# Altium schematic sheet Step_Down.SchDoc
size 297 x 209 mm; SheetNumber: 9; SheetTotal: 9
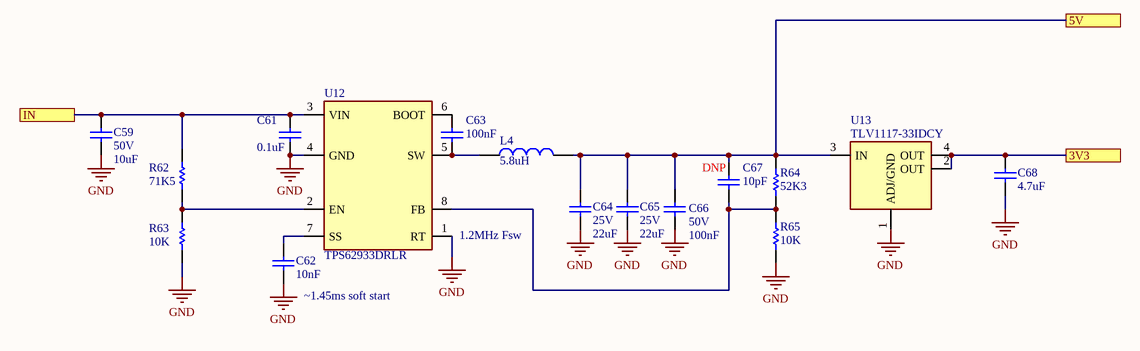
[diagram p0: Step_Down.SchDoc]

## Parts
C59  Voltage Rating: 50V  Capacitance: 10uF  [CAPC1210X090]  (hidden comment: CL32B106KBJNNNE)
C61  Capacitance: 0.1uF  [CAPC0402X020]  (hidden comment: CL05B104KB5NNNC)
C62  Capacitance: 10nF  [CAPC0603X060]  (hidden comment: CL10B103KB8NNNC)
C63  Capacitance: 100nF  [CAPC0603X040]  (hidden comment: C0603C104K5RACTU)
C64  Voltage Rating: 25V  Capacitance: 22uF  [CAPC1210X090]  (hidden comment: CL32B226KAJNNNE)
C65  Voltage Rating: 25V  Capacitance: 22uF  [CAPC1210X090]  (hidden comment: CL32B226KAJNNNE)
C66  Voltage Rating: 50V  Capacitance: 100nF  [CAPC0603X040]  (hidden comment: C0603C104K5RACTU)
C67  Capacitance: 10pF  [CAPC0603X040]  (hidden comment: C0603C104K5RACTU)
C68  Capacitance: 4.7uF  [CAPC0805X060]  (hidden comment: CL21B475KOFNFNE)
L4  744316560  [744316560]  (value not drawn)
R62  Resistance: 71K5  [RESC0603]  (hidden comment: RMCF0603FT71K5)
R63  Resistance: 10K  [RESC0603]  (hidden comment: RMCF0603FT10K0)
R64  Resistance: 52K3  [RESC0603]  (hidden comment: RMCF0603FT52K3)
R65  Resistance: 10K  [RESC0603]  (hidden comment: RMCF0603FT10K0)
U12  TPS62933DRLR  [SOT-583]
U13  TLV1117-33IDCY  [TLV1117-33IDCY]

## Ports
3V3 (see Power_Path[6C]), 5V (see Power_Path[6C]), IN (see Power_Path[5C])

## Nets
GND: C59.1 C61.1 C62.1 C64.1 C65.1 C66.1 C68.1 R63.1 R65.1 U12.1(RT) U12.4(GND) U13.1(ADJ/GND)
3V3: C68.2 U13.2(OUT) U13.4(OUT) ; port 3V3
5V: C64.2 C65.2 C66.2 C67.2 L4.2 R64.2 U13.3(IN) ; port 5V
IN: C59.2 C61.2 R62.2 U12.3(VIN) ; port IN
NetC62_2: C62.2 U12.7(SS)
NetC63_1: C63.1 L4.1 U12.5(SW)
NetC63_2: C63.2 U12.6(BOOT)
NetC67_1: C67.1 R64.1 R65.2 U12.8(FB)
NetR62_1: R62.1 R63.2 U12.2(EN)

## Notes on the sheet
- (near L4) 5.8uH
- (near C67) DNP
- (near U12) 1.2MHz Fsw
- (near C62) ~1.45ms soft start
- Size:
- Title:
- Project:
- Rev:
- Date:
- Drawn By:
- Sheet:

## Library data of the parts
C59 = CL32B106KBJNNNE: 10 µF ±10% 50V Ceramic Capacitor X7R 1210 (3225 Metric); Manufacturer Part Number: CL32B106KBJNNNE; Distributor Part Number: 1276-3387-1-ND; Tolerance: 10%; Case Code: 1210; Distributor: Digikey
C61 = CL05B104KB5NNNC: 0.1 µF ±10% 50V Ceramic Capacitor X7R 0402 (1005 Metric); Part Number: CL05B104KB5NNNC; Tolerance: 10%; Distributor Part Number: 1276-CL05B104KB5NNNCCT-ND; Case Code: 0402; Distributor: Digikey; Voltage Rating: 50V
C62 = CL10B103KB8NNNC: 10nF ±10% 50V Ceramic Capacitor X7R 0603 (1608 Metric); Part Number: CL10B103KB8NNNC; Distributor Part Number: 1276-1009-1-ND; Tolerance: 10%; Case Code: 0603; Distributor: Digikey; Voltage Rating: 50V
C63 C66 = C0603C104K5RACTU: 0.1 µF ±10% 50V Ceramic Capacitor X7R 0603 (1608 Metric); Distributor Part Number: 399-C0603C104K5RACTUCT-ND; Tolerance: 10%; Case Code: 0603; Distributor: Digikey
  C63: Manufacturer Part Number: C0603C104K5RACTU; Voltage Rating: 50V
  C66: Part Number: C0603C104K5RACTU
C64 C65 = CL32B226KAJNNNE: 22 µF ±10% 25V Ceramic Capacitor X7R 1210 (3225 Metric); Part Number: CL32B226KAJNNNE; Distributor Part Number: 1276-3392-1-ND; Tolerance: 10%; Case Code: 1210; Distributor: Digikey
C67 = C0603C100J5GACTU: 10 pF ±5% 50V Ceramic Capacitor C0G, NP0 0603 (1608 Metric); Tolerance: 10%; Part Number: C0603C100J5GACTU; Distributor Part Number: 399-C0603C100J5GACTUCT-ND; Case Code: 0603; Distributor: Digikey; Voltage Rating: 50V
C68 = CL21B475KOFNFNE: 4.7 µF ±10% 16V Ceramic Capacitor X7R 0805 (2012 Metric); Part Number: CL21B475KOFNFNE; Distributor Part Number: 1276-2970-1-ND; Tolerance: 10%; Case Code: 0805; Distributor: Digikey; Voltage Rating: 16V
L4 = 744316560: Inductor 5.6uH 4.5A Shielded 28.5mOhm SMD; Saturation Current: 4.6A; Part Number: 744316560; Distributor Part Number: 732-6183-1-ND; Distributor: Digikey; Current Rating: 4.5A; DCR: 28.5mOhm
R62 = RMCF0603FT71K5: 71.5 kOhms ±1% 0.1W, 1/10W Chip Resistor 0603 (1608 Metric) Automotive AEC-Q200 Thick Film; Part Number: RMCF0603FT71K5; Tolerance: 1%; Distributor: Digikey; Distributor Part Number: RMCF0603FT71K5CT-ND; Case Code: 0603
R63 R65 = RMCF0603FT10K0: 10 kOhms ±1% 0.1W, 1/10W Chip Resistor 0603 (1608 Metric) Automotive AEC-Q200 Thick Film; Tolerance: 1%; Distributor Part Number: RMCF0603FT10K0CT-ND; Distributor: Digikey; Case Code: 0603; Part Number: RMCF0603FT10K0
R64 = RMCF0603FT52K3: 52.3 kOhms ±1% 0.1W, 1/10W Chip Resistor 0603 (1608 Metric) Automotive AEC-Q200 Thick Film; Part Number: RMCF0603FT52K3; Tolerance: 1%; Distributor: Digikey; Distributor Part Number: RMCF0603FT174KCT-ND; Case Code: 0603
U12 = TPS62933DRLR: Buck Switching Regulator IC Positive Adjustable 0.8V 1 Output 3A SOT-583; Voltage - Input (Min): 3.8V; Voltage - Input (Max): 30V; Voltage - Output (Max): 22V; Part Number: TPS62933DRLR; Distributor Part Number: 296-TPS62933DRLRCT-ND; Distributor: Digikey; Operating Temperature: -40°C ~ 150°C (TJ); Current Output: 3A; Voltage - Output (Min): 0.8V
U13 = TLV1117-33IDCY: 3.3V 800-mA, 15-V, linear voltage regulator 4-SOT-223 -40 to 125; Output Current: 800mA; Input Voltage - Min: 4.7V; Input Voltage - Max: 15V; Dropout Voltage: 1.2V; Part Number: TLV1117-33IDCY; Output Voltage: 3.3V; Operating Temperature: -40C~125C; Distributor: Digikey; Distributor Part Number: 296-26777-5-ND